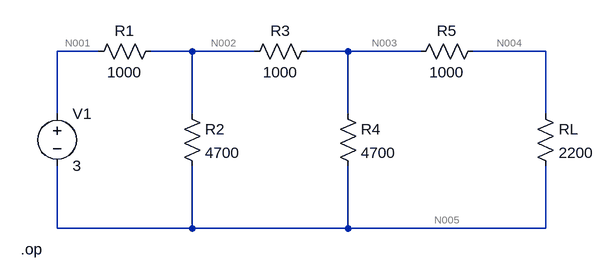
[diagram p0: schematic Figure44.asc]
Figure44.asc, the LTspice schematic file:
Version 4.1
SHEET 1 932 680
WIRE 160 32 96 32
WIRE 304 32 240 32
WIRE 400 32 304 32
WIRE 544 32 480 32
WIRE 656 32 544 32
WIRE 848 32 736 32
WIRE 96 128 96 32
WIRE 304 128 304 32
WIRE 544 128 544 32
WIRE 848 128 848 32
WIRE 96 304 96 208
WIRE 304 304 304 208
WIRE 304 304 96 304
WIRE 544 304 544 208
WIRE 544 304 304 304
WIRE 848 304 848 208
WIRE 848 304 544 304
SYMBOL voltage 96 112 R0
WINDOW 123 0 0 Left 0
WINDOW 39 0 0 Left 0
SYMATTR InstName V1
SYMATTR Value 3
SYMBOL res 256 16 R90
WINDOW 0 0 56 VBottom 2
WINDOW 3 32 56 VTop 2
SYMATTR InstName R1
SYMATTR Value 1000
SYMBOL res 288 112 R0
SYMATTR InstName R2
SYMATTR Value 4700
SYMBOL res 496 16 R90
WINDOW 0 0 56 VBottom 2
WINDOW 3 32 56 VTop 2
SYMATTR InstName R3
SYMATTR Value 1000
SYMBOL res 528 112 R0
SYMATTR InstName R4
SYMATTR Value 4700
SYMBOL res 752 16 R90
WINDOW 0 0 56 VBottom 2
WINDOW 3 32 56 VTop 2
SYMATTR InstName R5
SYMATTR Value 1000
SYMBOL res 832 112 R0
SYMATTR InstName RL
SYMATTR Value 2200
TEXT 40 336 Left 2 !.op

The netlist it stands for:
* Figure44.asc
V1 N001 N005 3
R1 N002 N001 1000
R2 N002 N005 4700
R3 N003 N002 1000
R4 N003 N005 4700
R5 N004 N003 1000
RL N004 N005 2200
.op
.backanno
.end

* Results of the author's LTspice run, read from the files saved beside the schematic
* Operating Point:
*   V(n001) = 2.132 V
*   V(n002) = 1.058 V
*   V(n003) = 394.7 mV
*   V(n004) = 0 V
*   V(n005) = -868.4 mV
*   I(R1) = -1.073 mA
*   I(R2) = 409.9 µA
*   I(R3) = -663.5 µA
*   I(R4) = 268.8 µA
*   I(R5) = -394.7 µA
*   I(RL) = 394.7 µA
*   I(V1) = -1.073 mA